# EAGLE design Laser_Driver_1 (EAGLE 7.2.0)
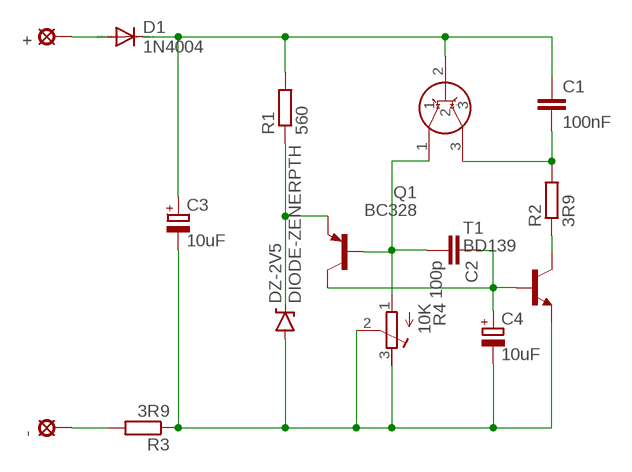
[diagram p0: schematic, sheet 1]

## Parts
+  LSP10  [LSP10]
-  LSP10  [LSP10]
C1  100nF  C5/5  [C5B5]
C2  100p  C5/5  [C5B5]
C3  10uF  CPOL-EUE2,5-6E  [E2,5-6E]
C4  10uF  CPOL-EUE2,5-6E  [E2,5-6E]
D1  1N4004  [DO41-10]
DZ-2V5  DIODE-ZENERPTH  [DIODE-ZENER]
LDIR_1  LD_IR  LD-IR-TO18  [LASER_IR_TO18]
Q1  BC328  [TO92-EBC]
R1  560  R-EU_0207/7  [0207/7]
R2  3R9  R-EU_0207/7  [0207/7]
R3  3R9  R-EU_0207/7  [0207/7]
R4  10K  R-TRIMM3339P  [RTRIM3339P]
T1  BD139  [TO126]

## Nets
N$1: +.MP D1.A
N$2: -.MP R3.2
N$3: C1.1 C3.+ D1.C LDIR_1.2 R1.2
N$4: C3.- C4.- DZ-2V5.P$2(A) R3.1 R4.2(S) R4.3(E) T1.1(E)
N$5: C2.2 LDIR_1.1 Q1.B R4.1(A)
N$6: C1.2 LDIR_1.3 R2.2
N$7: C2.1 C4.+ Q1.C T1.3(B)
N$8: R2.1 T1.2(C)
N$9: DZ-2V5.P$1(C) Q1.E R1.1

## Library data of the parts
+ - = solpad:LSP10: SOLDER PAD drill 1.0 mm, distributor Buerklin, 12H555
C1 C2 = capacitor-wima:C: CAPACITOR naming: grid - package width
C3 C4 = rcl:CPOL-EU: POLARIZED CAPACITOR, European symbol
D1 = diode:1N4004: DIODE general purpose rectifier, 1 A
DZ-2V5 = SparkFun-DiscreteSemi:DIODE-ZENER: Zener Diode Production Part - 8199 3.4V Zener Voltage
LDIR_1 = Erik:LD-IR-TO18
Q1 = transistor-pnp:BC328*: PNP Transistror
R1-R3 = rcl:R-EU_: RESISTOR, European symbol
R4 = rcl:R-TRIMM: Trimm resistor
T1 = transistor:BD139: NPN TRANSISTOR

## Board
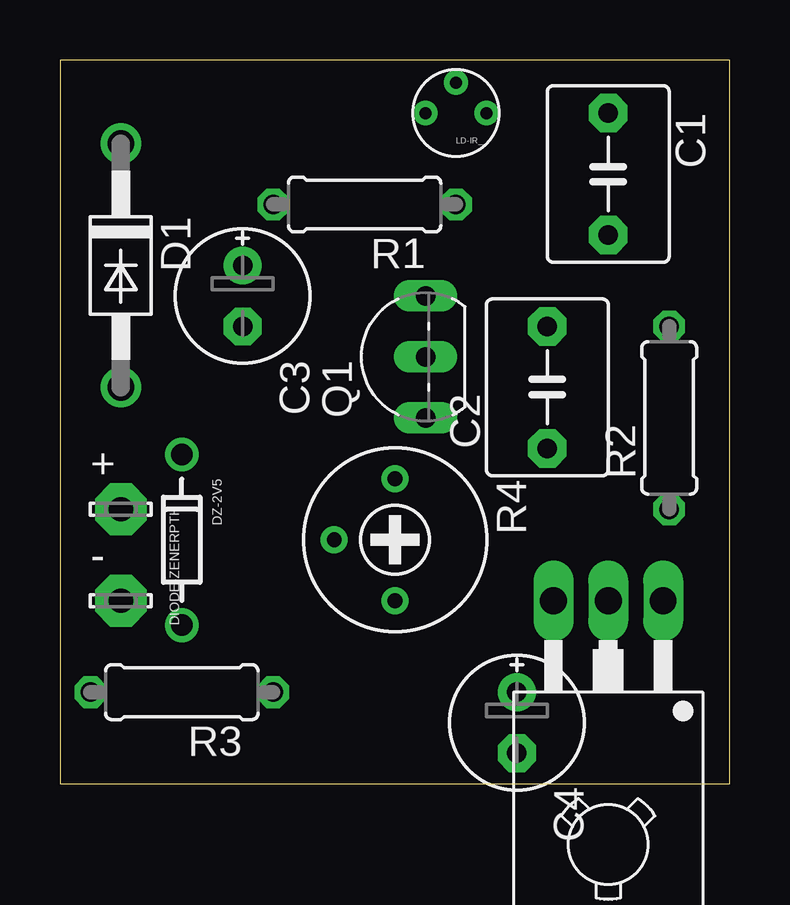
[diagram p1: board, top side]
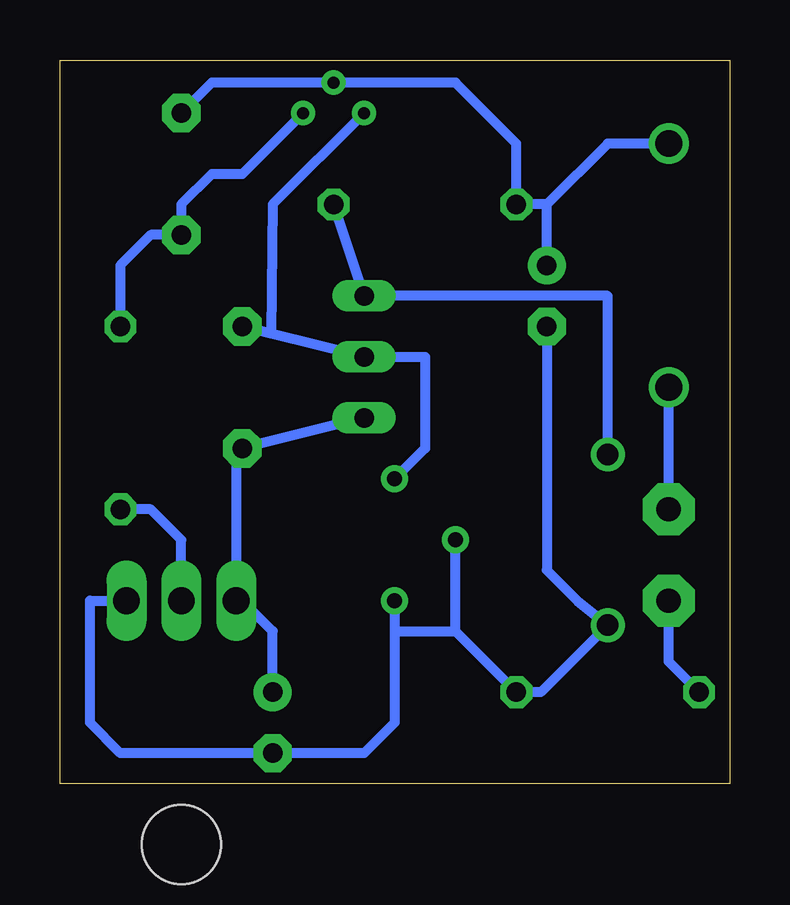
[diagram p2: board, bottom side, seen from below]

Size 27.92 x 30.15 mm. Coordinates in mm from the lower left corner, seen from the top.
Outline: 0,0 27.92,0 27.92,30.15 0,30.15 0,0
Copper layers (1*16): Top 0.035mm / dielectric 1.5mm / Bottom 0.035mm
Design rules "default": minimum track width 10mil, minimum drill 24mil, track to track 8mil, track to pad 8mil, pad to pad 8mil, via to via 8mil, smd to smd 8mil, copper to edge 40mil, drill to drill 8mil, minimum pad ring 10mil, minimum via ring 8mil, stop-mask expansion 4mil, vias tented up to drill 0mil, thermal gap 10mil

### Footprints (pad centres in the part's own frame; a part is rotated, then mirrored left to right if it is on the bottom)
LSP10 = drill 1.016 pad 2.159 octagon: MP 0,0
C5B5 = drill 0.813 pad 1.6 octagon: 1 -2.54,0; 2 2.54,0
E2,5-6E = drill 0.813 pad 1.575: + -1.27,0 | drill 0.813 pad 1.575 octagon: - 1.27,0
DO41-10 = drill 1.118: A 5.08,0; C -5.08,0
DIODE-ZENER = drill 0.9: P$1 -3.556,0; P$2 3.556,0
LASER_IR_TO18 = drill 0.5 pad 0.813: 1 -1.27,0; 2 0,1.27; 3 1.27,0
TO92-EBC = drill 0.813 long: B 0,-1.27; C -2.54,-1.27; E 2.54,-1.27
0207/7 = drill 0.813 octagon: 1 -3.81,0; 2 3.81,0
RTRIM3339P = drill 0.61: 1 -2.54,0; 2 0,-2.54; 3 2.54,0
TO126 = drill 1.118 long: 1 -2.286,-5.08; 2 0,-5.08; 3 2.286,-5.08 | hole 3.302: 0,5.08

### Placement (x,y rotation side)
+  2.54,11.43 0 top
-  2.54,7.62 0 top
C1  22.86,25.4 270 top
C2  20.32,16.51 90 top
C3  7.62,20.32 270 top
C4  19.05,2.54 270 top
D1  2.54,21.59 270 top
DZ-2V5  5.08,10.16 270 top
LDIR_1  16.51,27.94 0 top
Q1  13.97,17.78 90 top
R1  12.7,24.13 180 top
R2  25.4,15.24 90 top
R3  5.08,3.81 180 top
R4  13.97,10.16 270 top
T1  22.86,2.54 180 top

### Tracks (layer width: path | path; a pad name or v marks a point on that pad's centre or on a via)
N$1
  Bottom 0.406: +.MP D1.A
N$2
  Bottom 0.406: R3.2 2.54,5.08 -.MP
N$3
  Bottom 0.406: D1.C 5.08,26.67 7.62,24.13 | 7.62,24.13 R1.2 8.89,26.67 11.43,29.21 LDIR_1.2 21.59,29.21 C1.1 | C3.+ 7.62,24.13
N$4
  Bottom 0.406: 11.43,6.35 R3.1 7.87,3.81 DZ-2V5.P$2 6.35,7.62 7.62,8.89 C3.- | 11.43,6.35 R4.2 | 11.43,6.35 13.97,6.35 R4.3 13.97,2.54 15.24,1.27 C4.- 25.4,1.27 26.67,2.54 26.67,7.62 T1.1
N$5
  Bottom 0.406: 19.12,18.75 Q1.B 12.7,17.78 12.7,13.97 R4.1 | 19.12,18.75 C2.2 | LDIR_1.1 19.05,24.13 19.12,18.75
N$6
  Bottom 0.406: R2.2 25.4,21.59 24.13,22.86 C1.2 22.86,24.13 21.59,25.4 20.32,25.4 LDIR_1.3
N$7
  Bottom 0.406: Q1.C C2.1 20.57,13.72 T1.3 20.32,7.62 19.05,6.35 C4.+
N$8
  Bottom 0.406: T1.2 22.86,10.16 24.13,11.43 R2.1
N$9
  Bottom 0.406: DZ-2V5.P$1 5.08,20.32 Q1.E R1.1